# Altium schematic sheet PSC_LED_KEYBOARD.SchDoc: LED KEYBOARD for NEXYS 4 DDR
size A4; Author: MGasiorowski; SheetNumber: 1; SheetTotal: 2; Model: PSC_1; PageSetup: Record=PageOptions|CenterHorizontal=True|CenterVertical=True|PrintScale=0.52|XCorrection=1.00|YCorrection=1.00|PrintKind=1|BorderSize=5000000|LeftOffset=0|BottomOffset=0|Orientation=2|PaperLength=4200|PaperWidth=2970|Scale=100|PaperSource=7|PrintQuality=600|MediaType=1|DitherType=10|PaperKind=A3|PrintScaleMode=1
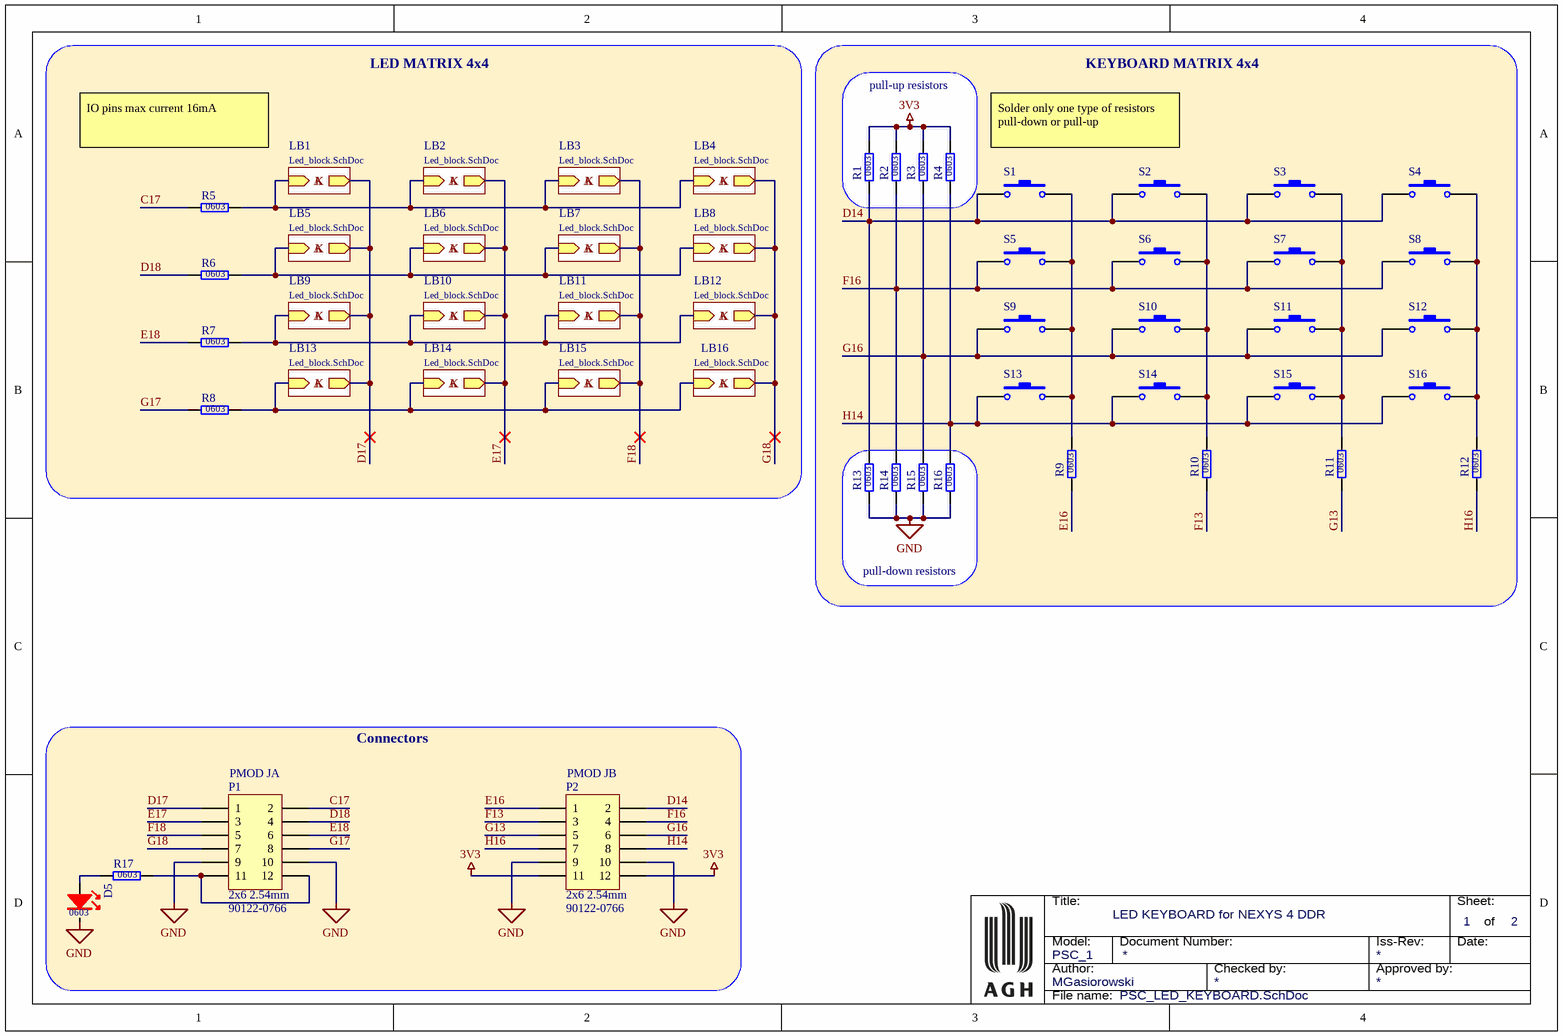
[diagram p0: PSC_LED_KEYBOARD.SchDoc]

## Parts
D5  SCH_Footprint: 0603  [OL_0603_1608]  (hidden comment: Red LED 0603)
P1  value 90122-0766  SCH_Footprint: 2x6 2.54mm  [P_HEADER_2x6_2.54_RIGHT_ANGLE]  (hidden comment: Goldpin male)
P2  value 90122-0766  SCH_Footprint: 2x6 2.54mm  [P_HEADER_2x6_2.54_RIGHT_ANGLE]  (hidden comment: Goldpin male)
R1  SCH_Footprint: 0603  [R_0603_1608]  (hidden comment: Resistor)
R2  SCH_Footprint: 0603  [R_0603_1608]  (hidden comment: Resistor)
R3  SCH_Footprint: 0603  [R_0603_1608]  (hidden comment: Resistor)
R4  SCH_Footprint: 0603  [R_0603_1608]  (hidden comment: Resistor)
R5  SCH_Footprint: 0603  [R_0603_1608]  (hidden comment: Resistor)
R6  SCH_Footprint: 0603  [R_0603_1608]  (hidden comment: Resistor)
R7  SCH_Footprint: 0603  [R_0603_1608]  (hidden comment: Resistor)
R8  SCH_Footprint: 0603  [R_0603_1608]  (hidden comment: Resistor)
R9  SCH_Footprint: 0603  [R_0603_1608]  (hidden comment: Resistor)
R10  SCH_Footprint: 0603  [R_0603_1608]  (hidden comment: Resistor)
R11  SCH_Footprint: 0603  [R_0603_1608]  (hidden comment: Resistor)
R12  SCH_Footprint: 0603  [R_0603_1608]  (hidden comment: Resistor)
R13  SCH_Footprint: 0603  [R_0603_1608]  (hidden comment: Resistor)
R14  SCH_Footprint: 0603  [R_0603_1608]  (hidden comment: Resistor)
R15  SCH_Footprint: 0603  [R_0603_1608]  (hidden comment: Resistor)
R16  SCH_Footprint: 0603  [R_0603_1608]  (hidden comment: Resistor)
R17  SCH_Footprint: 0603  [R_0603_1608]  (hidden comment: Resistor)
S1  S_TACTSWITCH  [S_TactSwitch_12x12]  (value not drawn)
S2  S_TACTSWITCH  [S_TactSwitch_12x12]  (value not drawn)
S3  S_TACTSWITCH  [S_TactSwitch_12x12]  (value not drawn)
S4  S_TACTSWITCH  [S_TactSwitch_12x12]  (value not drawn)
S5  S_TACTSWITCH  [S_TactSwitch_12x12]  (value not drawn)
S6  S_TACTSWITCH  [S_TactSwitch_12x12]  (value not drawn)
S7  S_TACTSWITCH  [S_TactSwitch_12x12]  (value not drawn)
S8  S_TACTSWITCH  [S_TactSwitch_12x12]  (value not drawn)
S9  S_TACTSWITCH  [S_TactSwitch_12x12]  (value not drawn)
S10  S_TACTSWITCH  [S_TactSwitch_12x12]  (value not drawn)
S11  S_TACTSWITCH  [S_TactSwitch_12x12]  (value not drawn)
S12  S_TACTSWITCH  [S_TactSwitch_12x12]  (value not drawn)
S13  S_TACTSWITCH  [S_TactSwitch_12x12]  (value not drawn)
S14  S_TACTSWITCH  [S_TactSwitch_12x12]  (value not drawn)
S15  S_TACTSWITCH  [S_TactSwitch_12x12]  (value not drawn)
S16  S_TACTSWITCH  [S_TactSwitch_12x12]  (value not drawn)

## Blocks framed on the sheet
LED MATRIX 4x4: R5-R8
KEYBOARD MATRIX 4x4: R9-R12 S1-S16
pull-up resistors: R1-R4
pull-down resistors: R13-R16
Connectors: D5 P1 P2 R17

## Sub-sheets
LB1 = Led_block.SchDoc: A (in), K (out)
LB2 = Led_block.SchDoc: A (in), K (out)
LB3 = Led_block.SchDoc: A (in), K (out)
LB4 = Led_block.SchDoc: A (in), K (out)
LB5 = Led_block.SchDoc: A (in), K (out)
LB6 = Led_block.SchDoc: A (in), K (out)
LB7 = Led_block.SchDoc: A (in), K (out)
LB8 = Led_block.SchDoc: A (in), K (out)
LB9 = Led_block.SchDoc: A (in), K (out)
LB10 = Led_block.SchDoc: A (in), K (out)
LB11 = Led_block.SchDoc: A (in), K (out)
LB12 = Led_block.SchDoc: A (in), K (out)
LB13 = Led_block.SchDoc: A (in), K (out)
LB14 = Led_block.SchDoc: A (in), K (out)
LB15 = Led_block.SchDoc: A (in), K (out)
LB16 = Led_block.SchDoc: A (in), K (out)

## Nets
3V3: P2.11 P2.12 R1.2 R2.2 R3.2 R4.2
GND: D5.1(K) P1.9 P1.10 P2.9 P2.10 R13.1 R14.1 R15.1 R16.1
C17: P1.2 R5.1
D14: P2.2 R1.1 R13.2 S1.1 S2.1 S3.1 S4.1
D17: P1.1 ; sheet LB1/K, sheet LB5/K, sheet LB9/K, sheet LB13/K
D18: P1.4 R6.1
E16: P2.1 R9.1
E17: P1.3 ; sheet LB2/K, sheet LB6/K, sheet LB10/K, sheet LB14/K
E18: P1.6 R7.1
F13: P2.3 R10.1
F16: P2.4 R2.1 R14.2 S5.1 S6.1 S7.1 S8.1
F18: P1.5 ; sheet LB3/K, sheet LB7/K, sheet LB11/K, sheet LB15/K
G13: P2.5 R11.1
G16: P2.6 R3.1 R15.2 S9.1 S10.1 S11.1 S12.1
G17: P1.8 R8.1
G18: P1.7 ; sheet LB4/K, sheet LB8/K, sheet LB12/K, sheet LB16/K
H14: P2.8 R4.1 R16.2 S13.1 S14.1 S15.1 S16.1
H16: P2.7 R12.1
NetD5_2: D5.2(A) R17.1
NetP1_11: P1.11 P1.12 R17.2
NetR5_2: R5.2 ; sheet LB1/A, sheet LB2/A, sheet LB3/A, sheet LB4/A
NetR6_2: R6.2 ; sheet LB5/A, sheet LB6/A, sheet LB7/A, sheet LB8/A
NetR7_2: R7.2 ; sheet LB9/A, sheet LB10/A, sheet LB11/A, sheet LB12/A
NetR8_2: R8.2 ; sheet LB13/A, sheet LB14/A, sheet LB15/A, sheet LB16/A
NetR9_2: R9.2 S1.2 S5.2 S9.2 S13.2
NetR10_2: R10.2 S2.2 S6.2 S10.2 S14.2
NetR11_2: R11.2 S3.2 S7.2 S11.2 S15.2
NetR12_2: R12.2 S4.2 S8.2 S12.2 S16.2

## Notes on the sheet
- IO pins max current 16mA
- Solder only one type of resistors pull-down or pull-up
- (near P1) PMOD JA
- (near P2) PMOD JB
- Title:
- Sheet:
- of
- Author:
- Model:
- Document Number:
- Checked by:
- Iss-Rev:
- Approved by:
- Date:
- File name:

## Library data of the parts
D5 = OL_R_0603_LTST-C193KRKT-5A: LED_RED; Manufacturer: Lite-On; Value: LTST-C193KRKT-5A; Part Number: OL_R_0603_LTST-C193KRKT-5A; HelpURL: https://pl.mouser.com/datasheet/2/239/LTST-C193KRKT-5A-1141706.pdf; Manufacturer Part Number: LTST-C193KRKT-5A; Supplier 1: TME; Supplier Part Number 1: LTST-C193KRKT-5A; Supplier 2: RS Components; Supplier Part Number 2: 6921041; Supplier 3: Farnell; Supplier 4: Mouser; Supplier Part Number 4: 859-LTSTC193KRKT5A; Supplier 5: Digi-Key; Supplier Part Number 5: 160-1830-1-ND; Supplier 6: LCSC
P1 P2 = P_HEADER_2x6_2.54_ANGLE: Pin Header; Manufacturer: Molex; Part Number: P_HEADER_2x6_2.54_ANGLE; HelpURL: https://datasheet.octopart.com/90122-0766-Molex-datasheet-101610747.pdf; Manufacturer Part Number: 90122-0766; Supplier 1: TME; Supplier 2: RS Components; Supplier Part Number 2: 3606572; Supplier 3: Farnell; Supplier Part Number 3: 9733710; Supplier 4: Mouser; Supplier Part Number 4: 538-90122-0766; Supplier 5: Digi-Key; Supplier Part Number 5: WM50030-12-ND; Supplier 6: LCSC
R1-R17 = R_10k_0603_0.1: Manufacturer: Panasonic; Manufacturer Part Number: ERA3ARB103V; Value: 10k; Voltage: 75V; Power: 100mW; Tolerance: 0.1%; Part Number: R_10k_0603_0.1; HelpURL: https://www.mouser.pl/datasheet/2/315/AOA0000C307-1149632.pdf; Supplier 1: TME; Supplier Part Number 1: ERA3ARB103V; Supplier 2: RS Components; Supplier Part Number 2: 1829211; Supplier 3: Farnell; Supplier Part Number 3: 1717597; Supplier 4: Mouser; Supplier Part Number 4: 667-ERA-3ARB103V; Supplier 5: Digi-Key; Supplier Part Number 5: P10KBDCT-ND; Supplier 6: LCSC
S1-S16 = S_TACTSWITCH: Tact switch